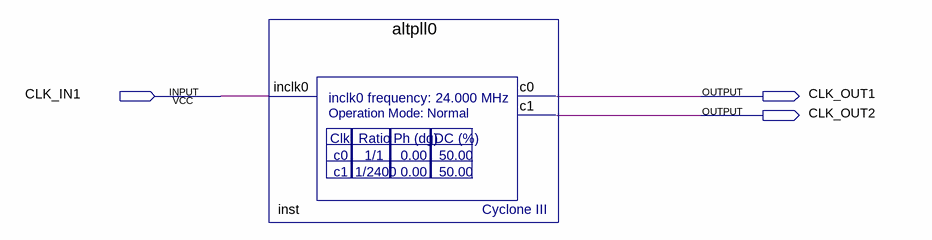
[diagram p0: schematic sheet]
// Quartus schematic pll.bdf as structural Verilog: 1 symbols, 3 pins
module pll (
  input  CLK_IN1,
  output CLK_OUT1,
  output CLK_OUT2
);

  altpll0 inst (.inclk0(CLK_IN1), .c0(CLK_OUT1), .c1(CLK_OUT2));
endmodule
